# EAGLE design 2LD-24-mk-1.0.0 (EAGLE 7.5.0)
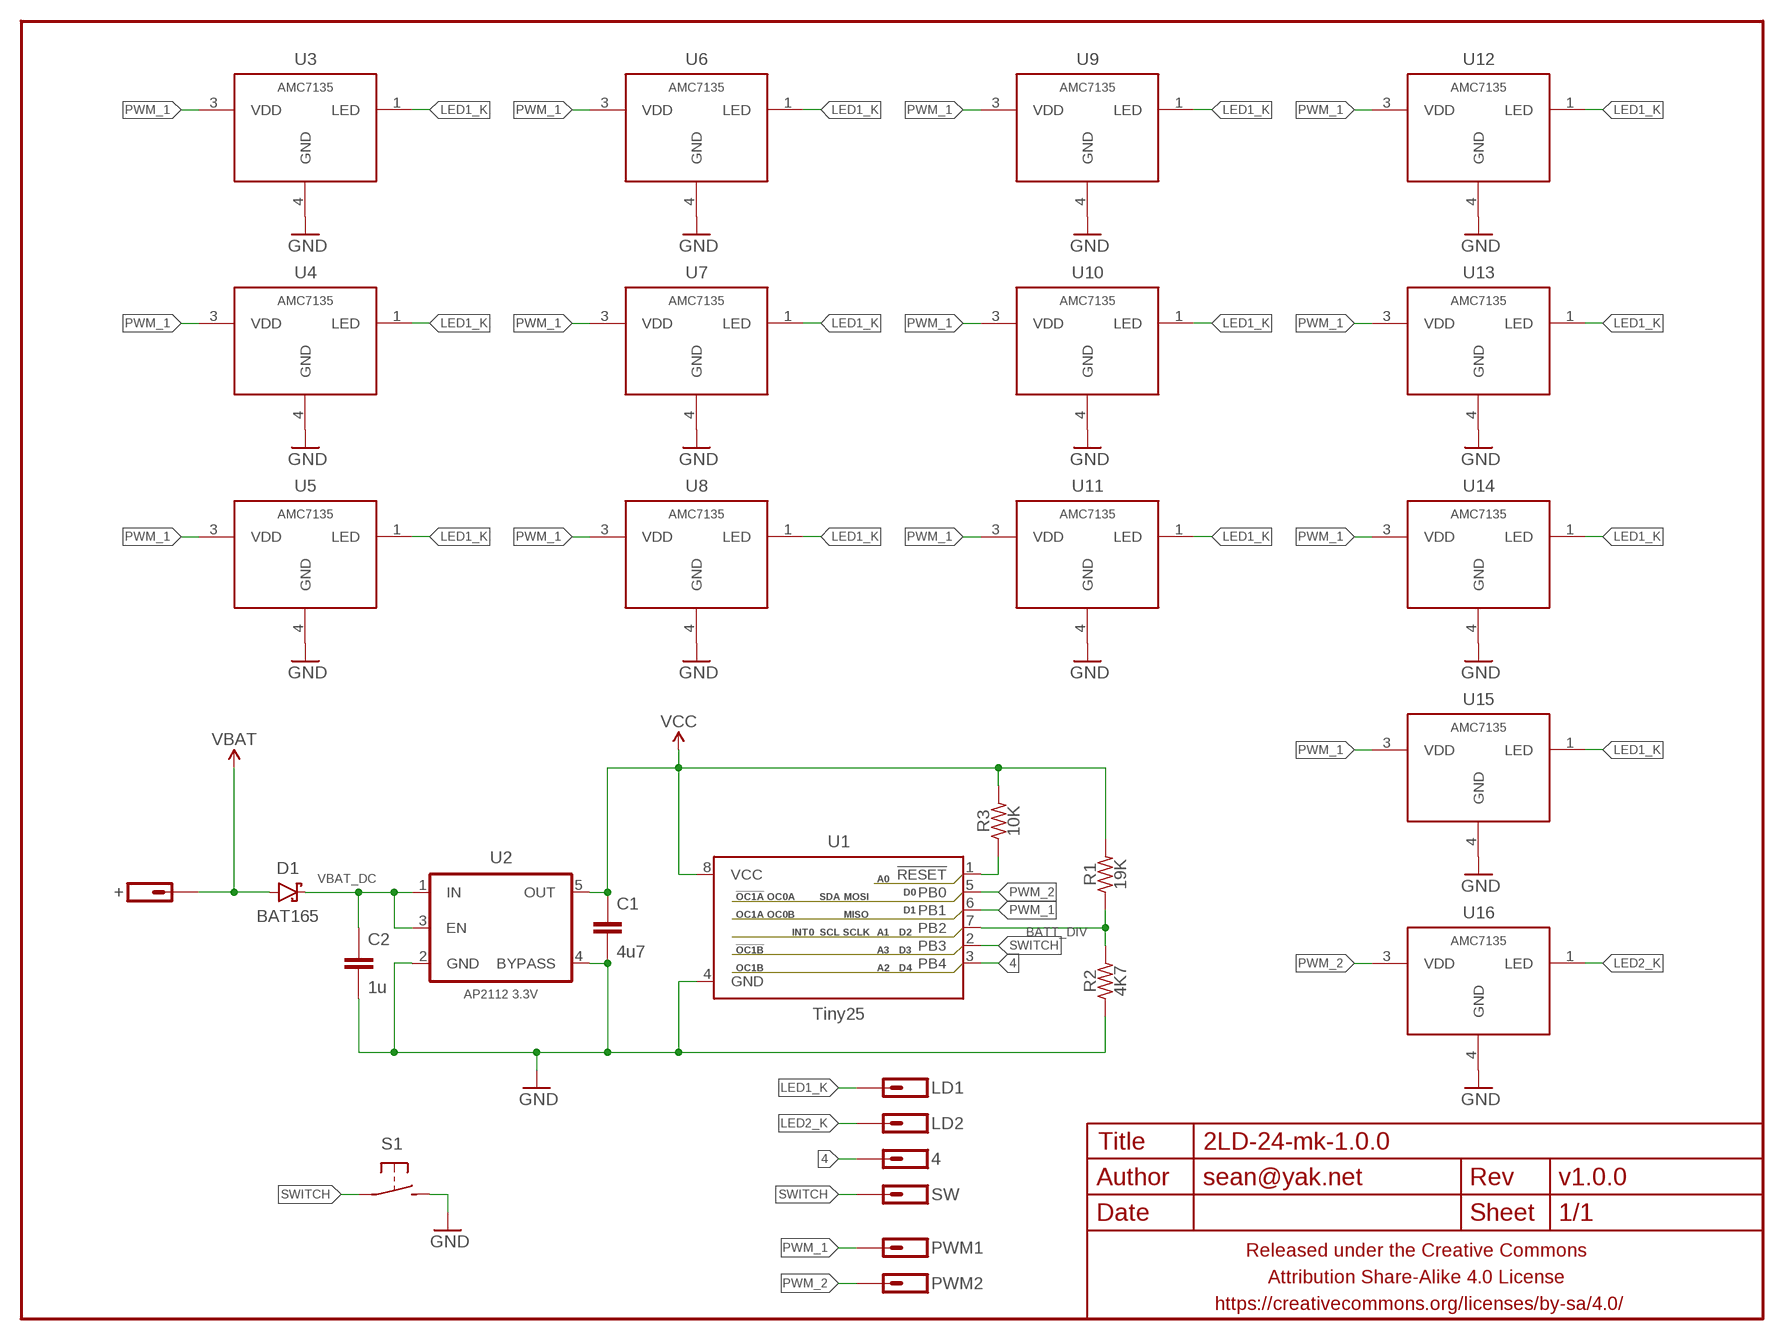
[diagram p0: schematic, sheet 1]

## Parts
4  M01SMD-0.8MM-DIA-NS  [1X01-SMD-0.8MM-DIA-NS]
+  M01PTH-1MM-CIR-NS  [1X01-1MM-CIR-NS]
C1  4u7  CAPACITOR-CERAMICC0603-TIGHTER  [C0603-TIGHTER]
C2  1u  CAPACITOR-CERAMICC0603-TIGHTER  [C0603-TIGHTER]
D1  BAT165  DIODE-SCHOTTKYSOD323  [SOD323-SCHOTTKY]
FRAME1  FRAME-LETTERNO_PACKAGE  [DUMMY]
LD1  M01PTH-1MM-CIR-NS  [1X01-1MM-CIR-NS]
LD2  M01PTH-0.8MM-CIR  [1X01-0.8MM-CIR]
PWM1  M01SMD-0.8MM-DIA-NS  [1X01-SMD-0.8MM-DIA-NS]
PWM2  M01SMD-0.8MM-DIA-NS  [1X01-SMD-0.8MM-DIA-NS]
R1  19K  RESISTORR0603-TIGHTER  [R0603-TIGHTER]
R2  4K7  RESISTORR0603-TIGHTER  [R0603-TIGHTER]
R3  10K  RESISTORR0603-TIGHTER  [R0603-TIGHTER]
S1  SPST-NO-TACT3MM-RA-SMALLER  [TACTILE-PTH-SIDE-SMALLER]
SW  M01SMD-0.8MM-DIA-NS  [1X01-SMD-0.8MM-DIA-NS]
U1  Tiny25  ATTINY13SOIC-NARROWPADS  [SO08-NARROWER]
U2  AP2112 3.3V  V_REG_SOT-23-5APA2112-SLIM  [SOT23-5-SLIM]
U3  AMC7135  AMC7135SOT-89-NOTHERM-ROUNDED-LESS  [SOT89-NOTHERM-ROUNDED-LESS]
U4  AMC7135  AMC7135SOT-89-NOTHERM-ROUNDED-LESS  [SOT89-NOTHERM-ROUNDED-LESS]
U5  AMC7135  AMC7135SOT-89-NOTHERM-ROUNDED-LESS  [SOT89-NOTHERM-ROUNDED-LESS]
U6  AMC7135  AMC7135SOT-89-NOTHERM-ROUNDED-LESS  [SOT89-NOTHERM-ROUNDED-LESS]
U7  AMC7135  AMC7135SOT-89-NOTHERM-ROUNDED-LESS  [SOT89-NOTHERM-ROUNDED-LESS]
U8  AMC7135  AMC7135SOT-89-NOTHERM-ROUNDED-LESS  [SOT89-NOTHERM-ROUNDED-LESS]
U9  AMC7135  AMC7135SOT-89-NOTHERM-ROUNDED-LESS  [SOT89-NOTHERM-ROUNDED-LESS]
U10  AMC7135  AMC7135SOT-89-NOTHERM-ROUNDED-LESS  [SOT89-NOTHERM-ROUNDED-LESS]
U11  AMC7135  AMC7135SOT-89-NOTHERM-ROUNDED-LESS  [SOT89-NOTHERM-ROUNDED-LESS]
U12  AMC7135  AMC7135SOT-89-NOTHERM-ROUNDED-LESS  [SOT89-NOTHERM-ROUNDED-LESS]
U13  AMC7135  AMC7135SOT-89-NOTHERM-ROUNDED-LESS  [SOT89-NOTHERM-ROUNDED-LESS]
U14  AMC7135  AMC7135SOT-89-NOTHERM-ROUNDED-LESS  [SOT89-NOTHERM-ROUNDED-LESS]
U15  AMC7135  AMC7135SOT-89-NOTHERM-ROUNDED-LESS  [SOT89-NOTHERM-ROUNDED-LESS]
U16  AMC7135  AMC7135SOT-89-NOTHERM-ROUNDED-LESS  [SOT89-NOTHERM-ROUNDED-LESS]

## Nets
4: 4.P$1 U1.3(PB4)
BATT_DIV: R1.1 R2.2 U1.7(PB2)
GND: C1.2 C2.2 R2.1 S1.2 U1.4(GND) U2.2(GND) U2.4(BYPASS) U3.4(GND) U4.4(GND) U5.4(GND) U6.4(GND) U7.4(GND) U8.4(GND) U9.4(GND) U10.4(GND) U11.4(GND) U12.4(GND) U13.4(GND) U14.4(GND) U15.4(GND) U16.4(GND)
LED1_K: LD1.1 U3.1(LED) U4.1(LED) U5.1(LED) U6.1(LED) U7.1(LED) U8.1(LED) U9.1(LED) U10.1(LED) U11.1(LED) U12.1(LED) U13.1(LED) U14.1(LED) U15.1(LED)
LED2_K: LD2.1 U16.1(LED)
N$1: R3.1 U1.1(!RESET)
PWM_1: PWM1.P$1 U1.6(PB1) U3.3(VDD) U4.3(VDD) U5.3(VDD) U6.3(VDD) U7.3(VDD) U8.3(VDD) U9.3(VDD) U10.3(VDD) U11.3(VDD) U12.3(VDD) U13.3(VDD) U14.3(VDD) U15.3(VDD)
PWM_2: PWM2.P$1 U1.5(PB0) U16.3(VDD)
SWITCH: S1.1 SW.P$1 U1.2(PB3)
VBAT: +.1 D1.A
VBAT_DC: C2.1 D1.C U2.1(IN) U2.3(EN)
VCC: C1.1 R1.2 R3.2 U1.8(VCC) U2.5(OUT)

## Library data of the parts
4 + LD1 LD2 PWM1 PWM2 SW = a_parts:M01: Header 1 Standard 1-pin 0.1" header. Use with straight break away headers (SKU : PRT-00116), right angle break away headers (PRT-00553), swiss pins (PRT-00743), machine pins (PRT-00117), and female headers (PRT-00115).
C1 C2 = a_parts:CAPACITOR-CERAMIC: CAPACITOR, European symbol
D1 = a_parts:DIODE-SCHOTTKY: Schottky diodes in SFE's production catalog BAT20J 1A 23V 0.62Vf RB751 120mA 40V 0.37Vf PMEG4005EJ 0.5A 40V 0.42Vf MBRA140 1A 40V 0.5Vf B340A 3A 40V SMA
FRAME1 = a_parts:FRAME-LETTER: Schematic Frame Standard 8.5x11 US Letter frame; DESIGNER: sean@yak.net; VERSION: v1.0.0
R1-R3 = a_parts:RESISTOR: RESISTOR, American symbol
S1 = a_parts:SPST-NO-TACT
U1 = a_parts:ATTINY13: Atmel 8-pin 1kB flash uC
U2 = a_parts:V_REG_SOT-23-5
U3-U16 = a_parts:AMC7135

## Board
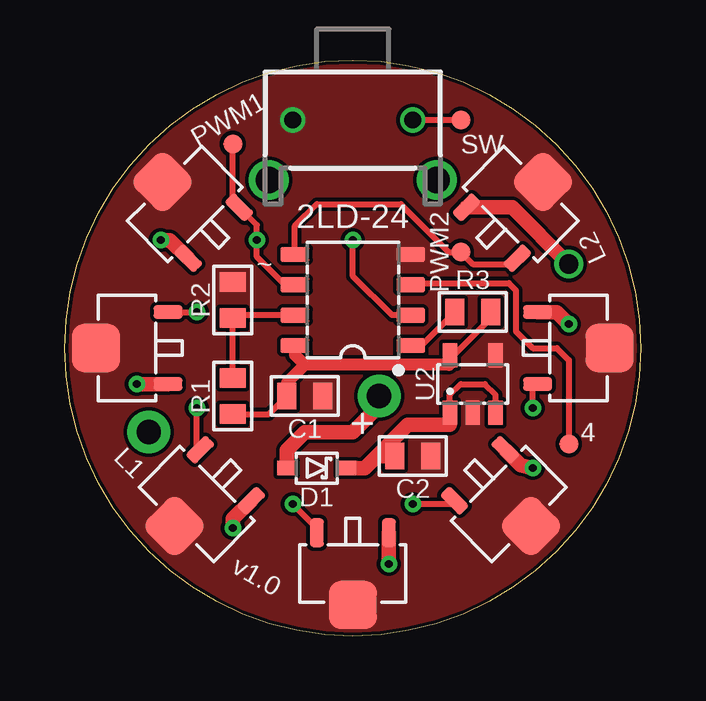
[diagram p1: board, top side]
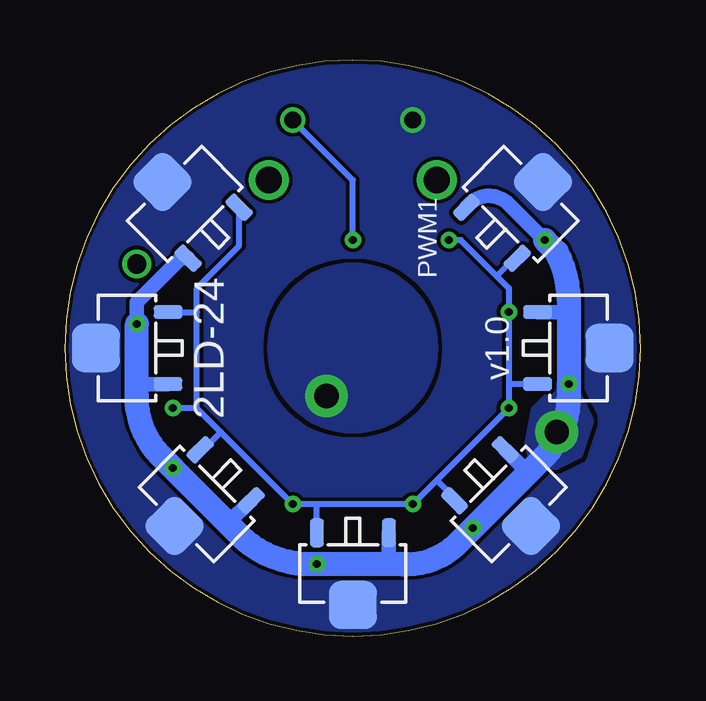
[diagram p2: board, bottom side, seen from below]

Size 24 x 24 mm. Coordinates in mm from the lower left corner, seen from the top.
Outline: 0,12 arc-180 24,12 arc-180 0,12
Copper layers (1*16): Top 0.0356mm / dielectric 1.5011mm / Bottom 0.0356mm
Design rules "LaenPCBOrder2": minimum track width 6mil, minimum drill 13mil, track to track 6mil, track to pad 6mil, pad to pad 6mil, via to via 6mil, smd to smd 6mil, copper to edge 6mil, drill to drill 6mil, minimum pad ring 7mil, minimum via ring 7mil, stop-mask expansion 3mil, vias tented up to drill 20mil, thermal gap 10mil

### Footprints (pad centres in the part's own frame; a part is rotated, then mirrored left to right if it is on the bottom)
1X01-SMD-0.8MM-DIA-NS = smd 0.8 x 0.8: P$1 0,0
1X01-1MM-CIR-NS = drill 1.016 pad 1.778: 1 0,0
C0603-TIGHTER = smd 0.8 x 1.1: 1 -0.75,0; 2 0.75,0
SOD323-SCHOTTKY = smd 0.8 x 0.6: A -1.25,0; C 1.25,0
1X01-0.8MM-CIR = drill 0.8: 1 0,0
R0603-TIGHTER = smd 0.8 x 1.1: 1 -0.75,0; 2 0.75,0
TACTILE-PTH-SIDE-SMALLER = drill 0.7: 1 -2.5,0; 2 2.5,0 | drill 1.1: ANCHOR1 -3.5,2.5; ANCHOR2 3.5,2.5
SO08-NARROWER = smd 0.6 x 1.2: 1 -1.905,-2.416; 2 -0.635,-2.416; 3 0.635,-2.416; 4 1.905,-2.416; 5 1.905,2.416; 6 0.635,2.416; 7 -0.635,2.416; 8 -1.905,2.416
SOT23-5-SLIM = smd 0.6 x 1: 1 -0.95,-1.2; 2 0,-1.2; 3 0.95,-1.2; 4 0.95,1.2; 5 -0.95,1.2
SOT89-NOTHERM-ROUNDED-LESS = smd 0.58 x 1.2: 1 -1.5,-1.7; 3 1.5,-1.7 | smd 2 x 2: 4 0,1.3

### Placement (x,y rotation side)
4  21,8 0 top
+  13.1,10 90 top
C1  10,10 0 top
C2  14.5,7.5 0 top
D1  10.5,7 0 top
FRAME1  0,0 0 top
LD1  3.5,8.5 270 top
LD2  21,15.5 90 top
PWM1  7,20.5 0 top
PWM2  16.5,16 180 top
R1  7,10 270 top
R2  7,14 270 top
R3  17,13.5 0 top
S1  12,21.5 180 top
SW  16.5,21.5 0 top
U1  12,14 90 top
U2  17,10.5 0 top
U3  19,18 45 bottom
U4  21.4,12 90 bottom
U5  18.5,5.5 135 bottom
U6  12,2.6 180 bottom
U7  5.5,5.5 225 bottom
U8  2.6,12 270 bottom
U9  5,18 315 bottom
U10  5,18 45 top
U11  21.4,12 270 top
U12  18.5,5.5 225 top
U13  12,2.6 180 top
U14  5.5,5.5 135 top
U15  2.6,12 90 top
U16  19,18 315 top

### Tracks (layer width: path | path; a pad name or v marks a point on that pad's centre or on a via)
4
  Top 0.25: U1.3 14.48,14.7 18.5,14.7 18.8,14.4 18.8,12.7 19.5,12 20.5,12 21,11.5 4.P$1
BATT_DIV
  Top 0.25: R1.1 R2.2 7.12,13.37 U1.7
GND
  pour Top (isolate 0.152, rank 6, no thermals): 0,12 arc90 12,0 arc90 24,12 arc90 12,24 arc90
  pour Bottom (isolate 0.152, rank 6, no thermals): 24,12 arc-90 12,0 arc-90 0,12 arc-90 12,24 arc-90
LED1_K  (via drill 0.33)
  Top 0.6: v21,13 20.5,13.5 U11.1 | v4,16.5 4.38,16.5 U10.1 | U13.1 v13.5,3 | U15.1 v3,10.5 | U12.1 19,7.12 v19.5,7 | U14.1 7,4.88 v7,4.5
  Bottom 0.6: v4,16.5 5.5,18 arc-99 U9.1 | U4.1 21,10.5 | U6.1 10.5,3 | U8.1 3,13.5 | U7.1 4.73,6.85 4.65,6.85 | U5.1 16.26,5.64 17.2,4.7 | U3.1 19.16,15.74 21,13.9 v21,13
  Bottom 1: v21,13 21,10.5 21,10 arc-46 20,7.5 arc-1 v19.5,7 17.2,4.7 16.5,4 arc-37 14,3 v13.5,3 10.5,3 10,3 arc-53 7.5,4 v7,4.5 4.65,6.85 4,7.5 arc-46 3,10 v3,10.5 3,13.5 3,14 arc-28 3.5,16 v4,16.5
  pour Bottom (isolate 0.152, rank 2, no thermals): 3,11 4.5,9.5 4.8,8 4.5,7 3.5,7 2.5,7.5 2,9
LED2_K
  Top 0.6: U16.1 18.64,17.86 LD2.1
N$1
  Top 0.25: U1.1 14.85,12.1 R3.1
PWM_1  (via drill 0.33)
  Top 0.25: U1.6 9.16,14.63 8,15.8 v8,16.5 8,17.12 U10.3 7,18.12 PWM1.P$1 | U15.3 v5.5,13.5 | v19.5,9.5 19.5,10.3 U11.3
  Top 0.254: v9.5,5.5 10.5,4.5 U13.3 | U12.3 16.1,5.5 v14.5,5.5 | U14.3 5.5,7.9 v5.5,9.5
  Bottom 0.25: 5.5,10.5 v5.5,13.5 5.5,14.5 6,15 | 13.6,5.5 v9.5,5.5 8.5,6.5 | 13.6,5.5 v14.5,5.5 17.5,8.5 | 18.5,9.5 18.5,13.5 | 18.5,13.5 18.5,14.5 16.74,16.26 U3.3 | 8.5,6.5 v5.5,9.5 5.5,10.5 | 6,15 7.5,16.5 v8,16.5 | U9.3 5.26,15.74 6,15 | U8.3 5.5,10.5 | 8.5,6.5 7.76,5.76 U7.3 | U6.3 13.5,5.4 13.6,5.5 | U5.3 18.24,7.76 17.5,8.5 | 17.5,8.5 18.5,9.5 | U4.3 18.5,13.5 | 18.5,9.5 v19.5,9.5
PWM_2
  Top 0.25: U1.5 9.58,17.08 10.5,18 14,18 16,16 PWM2.P$1
  Top 0.254: PWM2.P$1 17,15.5 18.5,15.5 18.74,15.74 U16.3
SWITCH  (via drill 0.33)
  Top 0.25: U1.2 13.63,13.37 12,15 v12,16.5 | SW.P$1 S1.1
  Bottom 0.25: v12,16.5 12,19 S1.1
VBAT
  Top 0.6: +.1 13.1,9.6 12,8.5 10,8.5 9.25,7.75 D1.A
  pour Bottom (isolate 0.152, no thermals): 8.5,12 arc-180 15.5,12 arc-180
VBAT_DC
  Top 0.25: U2.1 16.05,10.05 16.5,10.5 17.5,10.5 17.95,10.05 U2.3
  Top 0.6: D1.C 12.5,7 13,7.5 | 13,7.5 14.3,8.8 16.05,8.8 U2.1 | C2.1 13,7.5
VCC
  Top 0.25: U2.5 16.2,11.7 17.75,13.25 R3.2 | R1.2 8.5,9.25 C1.1
  Top 0.5: 10,11.3 16,11.3 16,11.65 U2.5 | C1.1 9.25,10.55 10,11.3 | U1.8 9.58,11.72 10,11.3

### Text on the board
tPlace: 2LD-24 | ~
bPlace: PWM1 | 2LD-24
tNames: L2 | L1